# EAGLE schematic pwr_block (EAGLE 6.5.0)
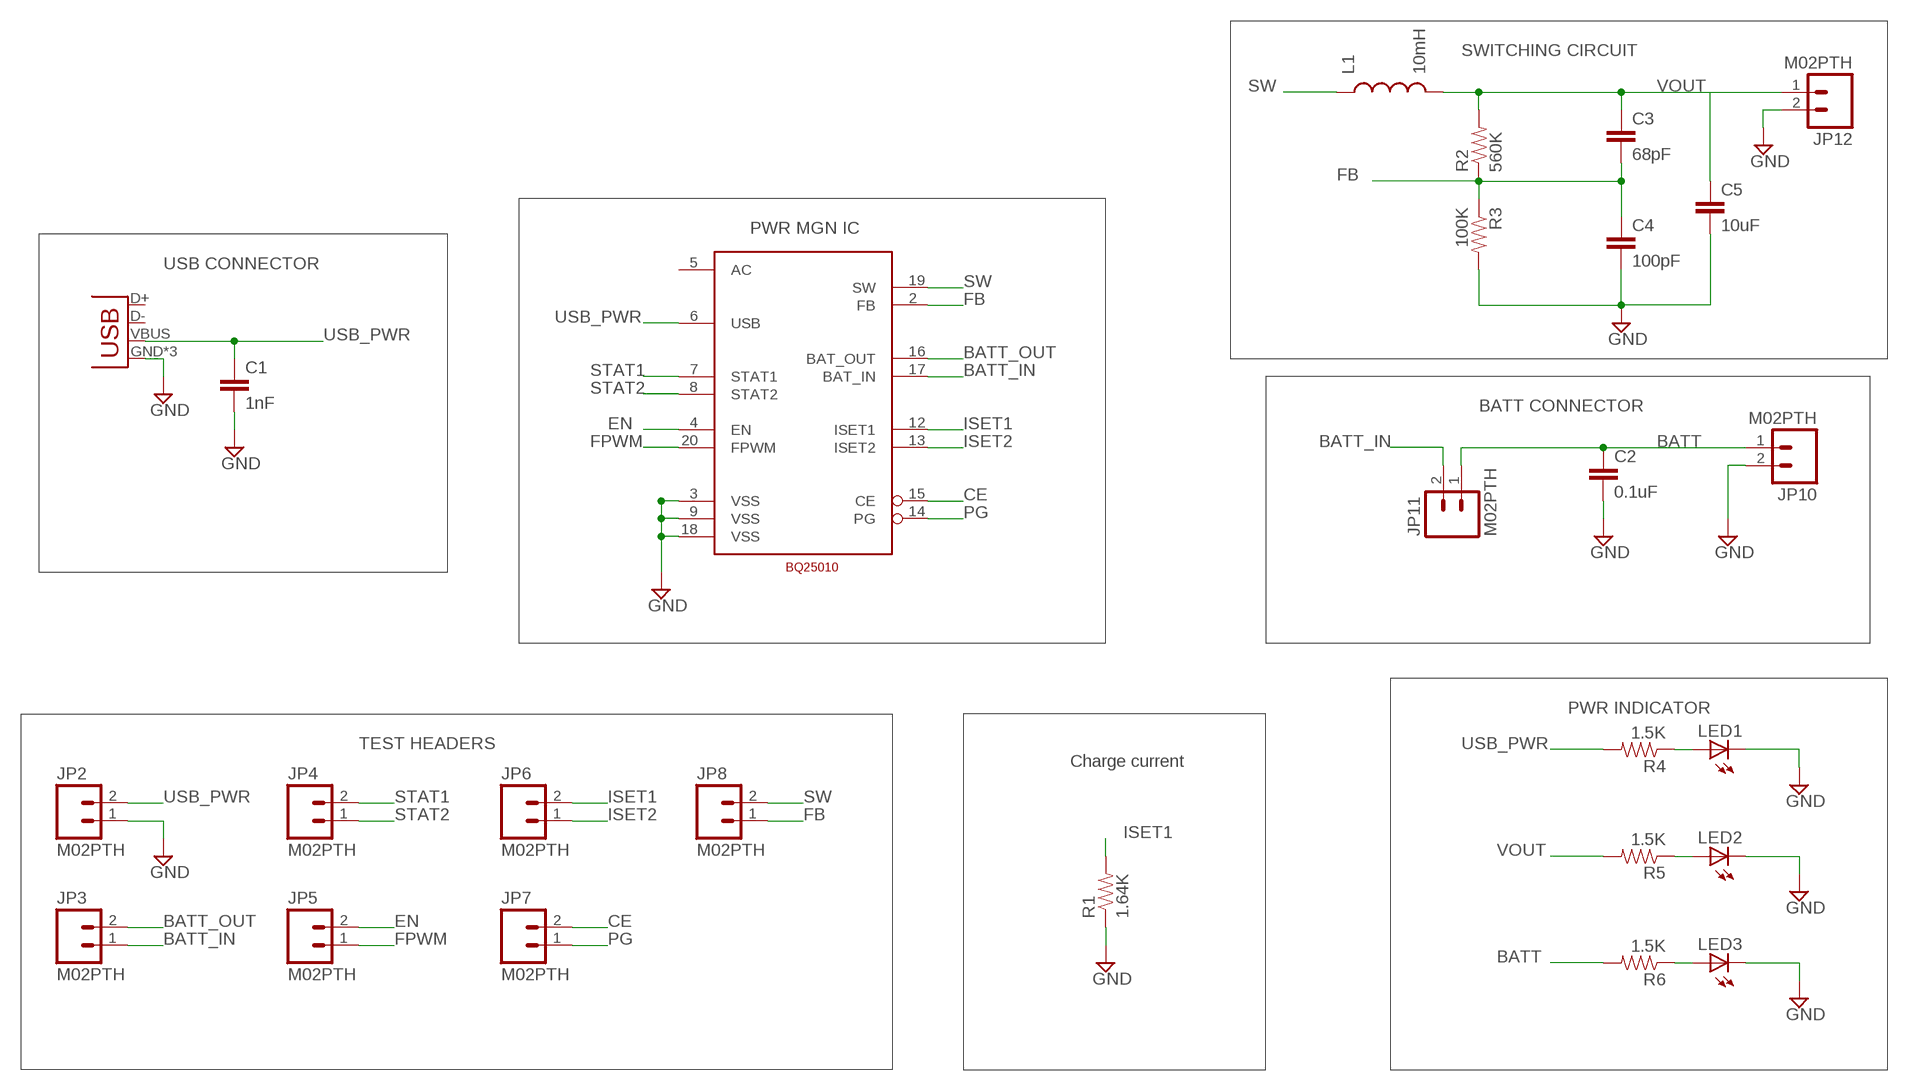
[diagram p0: schematic, sheet 1]

## Parts
C1  1nF  1NF/1000PF-50V-10%(0603)  [0603-CAP]
C2  0.1uF  0.1UF-100V-10%(0603)  [0603-CAP]
C3  68pF  10UF-6.3V-20%(0603)  [0603-CAP]
C4  100pF  10UF-6.3V-20%(0603)  [0603-CAP]
C5  10uF  10UF-6.3V-20%(0603)  [0603-CAP]
JP1  USB-MICROB  [USB-MICROB]
JP2  M02PTH  [1X02]
JP3  M02PTH  [1X02]
JP4  M02PTH  [1X02]
JP5  M02PTH  [1X02]
JP6  M02PTH  [1X02]
JP7  M02PTH  [1X02]
JP8  M02PTH  [1X02]
JP10  M02PTH  [1X02]
JP11  M02PTH  [1X02]
JP12  M02PTH  [1X02]
L1  10mH  INDUCTOR0603  [0603]
LED1  LED0603  [LED-0603]
LED2  LED0603  [LED-0603]
LED3  LED0603  [LED-0603]
R1  1.64K  RESISTOR0603-RES  [0603-RES]
R2  560K  RESISTOR0603-RES  [0603-RES]
R3  100K  RESISTOR0603-RES  [0603-RES]
R4  1.5K  RESISTOR0603-RES  [0603-RES]
R5  1.5K  RESISTOR0603-RES  [0603-RES]
R6  1.5K  RESISTOR0603-RES  [0603-RES]
U$1  BQ25010  [VQFN_RHL_20PIN]

## Nets
BATT: C2.1 JP10.1 JP11.1 R6.2
BATT_IN: JP3.1 JP11.2 U$1.17(BAT_IN)
BATT_OUT: JP3.2 U$1.16(BAT_OUT)
CE: JP7.2 U$1.15(CE)
EN: JP5.2 U$1.4(EN)
FB: C3.2 C4.1 JP8.1 R2.1 R3.1 U$1.2(FB)
FPWM: JP5.1 U$1.20(FPWM)
GND: C1.2 C2.2 C4.2 C5.2 JP1.GND JP1.MT1(GND) JP1.MT2(GND) JP2.1 JP10.2 JP12.2 LED1.C LED2.C LED3.C R1.1 R3.2 U$1.3(VSS) U$1.9(VSS) U$1.18(VSS)
ISET1: JP6.2 R1.2 U$1.12(ISET1)
ISET2: JP6.1 U$1.13(ISET2)
N$1: LED1.A R4.1
N$2: LED2.A R5.1
N$3: LED3.A R6.1
PG: JP7.1 U$1.14(PG)
STAT1: JP4.2 U$1.7(STAT1)
STAT2: JP4.1 U$1.8(STAT2)
SW: JP8.2 L1.1 U$1.19(SW)
USB_PWR: C1.1 JP1.VBUS JP2.2 R4.2 U$1.6(USB)
VOUT: C3.1 C5.1 JP12.1 L1.2 R2.2 R5.2
Unconnected: JP1.D+ JP1.D- U$1.5(AC)

## Notes on the sheet
- SWITCHING CIRCUIT
- PWR MGN IC
- USB CONNECTOR
- BATT CONNECTOR
- PWR INDICATOR
- TEST HEADERS
- Charge current

## Library data of the parts
C1 = SparkFun-Capacitors:1NF/1000PF-50V-10%(0603): CAP-07886; PROD_ID: CAP-07886
C2 = SparkFun-Capacitors:0.1UF-100V-10%(0603): CAP-08390; PROD_ID: CAP-08390
C3 C4 = SparkFun-Capacitors:10UF-6.3V-20%(0603): CAP-11015; PROD_ID: CAP-11015; VALUE: 10uF
C5 = SparkFun-Capacitors:10UF-6.3V-20%(0603): CAP-11015; PROD_ID: CAP-11015
JP1 = SparkFun-Connectors:USB: USB Connectors USB-B-PTH is fully proven SKU : PRT-00139/CONN-08278 USB-miniB is fully proven SKU : PRT-00587 USB-A-PCB is untested. USB-A-H is throughly reviewed, but untested. Spark Fun Electronics SKU : PRT-00437 USB-B-SMT is throughly reviewed, but untested. Needs silkscreen touching up. USB-A-S has not been used/tested USB-MB-H has not been used/tested USB-MICROB has been used. CONN-09505; DESCRIPTION: CONN RCPT STD MICRO USB TYPE B; PROD_ID: CONN-09505
JP2-JP8 JP10-JP12 = SparkFun-Connectors:M02: Standard 2-pin 0.1" header. Use with - straight break away headers ( PRT-00116) - right angle break away headers (PRT-00553) - swiss pins (PRT-00743) - machine pins (PRT-00117) - female headers (PRT-00115) Molex polarized connector foot print use with: PRT-08233 with associated crimp pins and housings. 2.54_SCREWTERM for use with PRT-10571. 3.5mm Screw Terminal footprints for PRT-08084 5mm Screw Terminal footprints for use with PRT-08433
L1 = SparkFun-Passives:INDUCTOR: Inductors Basic Inductor/Choke - 0603 and 1206. Footprints are not proven and vary greatly between part numbers. SRN6045- 33uH, 20% 1.4A SDR0403-560KL - 56uH, 10%, 500mA RMS/740mA peak
LED1-LED3 = SparkFun-LED:LED: LEDs Standard schematic elements and footprints for 5mm, 3mm, 1206, and 0603 sized LEDs. 5mm - Spark Fun Electronics SKU : COM-00529 (and others)
R1-R6 = SparkFun-Passives:RESISTOR: Resistor Basic schematic elements and footprints for 0603, 1206, and PTH resistors.
U$1 = TuansLib:BQ25010